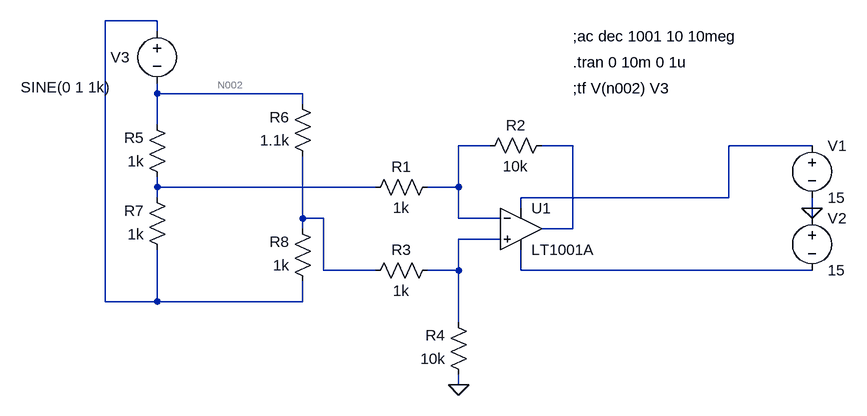
[diagram p0: schematic DifferentialAmp.asc]
DifferentialAmp.asc, the LTspice schematic file:
Version 4
SHEET 1 880 680
WIRE -240 -208 -320 -208
WIRE -240 -192 -240 -208
WIRE -240 -96 -240 -112
WIRE -16 -96 -240 -96
WIRE -16 -80 -16 -96
WIRE -240 -48 -240 -96
WIRE 272 -16 224 -16
WIRE 400 -16 352 -16
WIRE 768 -16 640 -16
WIRE -240 48 -240 32
WIRE 96 48 -240 48
WIRE 224 48 224 -16
WIRE 224 48 176 48
WIRE -240 64 -240 48
WIRE 640 64 640 -16
WIRE 640 64 320 64
WIRE 320 80 320 64
WIRE 768 80 768 64
WIRE -16 96 -16 0
WIRE 16 96 -16 96
WIRE 224 96 224 48
WIRE 288 96 224 96
WIRE 768 96 768 80
WIRE -16 112 -16 96
WIRE 400 112 400 -16
WIRE 400 112 352 112
WIRE 288 128 224 128
WIRE 16 176 16 96
WIRE 96 176 16 176
WIRE 224 176 224 128
WIRE 224 176 176 176
WIRE 320 176 320 144
WIRE 768 176 320 176
WIRE -320 224 -320 -208
WIRE -240 224 -240 144
WIRE -240 224 -320 224
WIRE -16 224 -16 192
WIRE -16 224 -240 224
WIRE 224 256 224 176
WIRE 224 352 224 336
FLAG 768 80 0
FLAG 224 352 0
SYMBOL res 192 32 R90
WINDOW 0 0 56 VBottom 2
WINDOW 3 32 56 VTop 2
SYMATTR InstName R1
SYMATTR Value 1k
SYMBOL res 368 -32 R90
WINDOW 0 0 56 VBottom 2
WINDOW 3 32 56 VTop 2
SYMATTR InstName R2
SYMATTR Value 10k
SYMBOL res 192 160 R90
WINDOW 0 0 56 VBottom 2
WINDOW 3 32 56 VTop 2
SYMATTR InstName R3
SYMATTR Value 1k
SYMBOL voltage 768 -32 R0
WINDOW 123 0 0 Left 2
WINDOW 39 0 0 Left 2
SYMATTR InstName V1
SYMATTR Value 15
SYMBOL voltage 768 80 R0
WINDOW 123 0 0 Left 2
WINDOW 39 0 0 Left 2
SYMATTR InstName V2
SYMATTR Value 15
SYMBOL Opamps\\LT1001A 320 48 R0
SYMATTR InstName U1
SYMBOL voltage -240 -208 R0
WINDOW 0 -72 56 Left 2
WINDOW 3 -210 102 Left 2
WINDOW 123 -154 130 Left 2
WINDOW 39 0 0 Left 2
SYMATTR InstName V3
SYMATTR Value SINE(0 1 1k)
SYMBOL res 240 352 R180
WINDOW 0 36 76 Left 2
WINDOW 3 36 40 Left 2
SYMATTR InstName R4
SYMATTR Value 10k
SYMBOL res -224 48 R180
WINDOW 0 36 76 Left 2
WINDOW 3 36 40 Left 2
SYMATTR InstName R5
SYMATTR Value 1k
SYMBOL res 0 16 R180
WINDOW 0 36 76 Left 2
WINDOW 3 36 40 Left 2
SYMATTR InstName R6
SYMATTR Value 1.1k
SYMBOL res -224 160 R180
WINDOW 0 36 76 Left 2
WINDOW 3 36 40 Left 2
SYMATTR InstName R7
SYMATTR Value 1k
SYMBOL res 0 208 R180
WINDOW 0 36 76 Left 2
WINDOW 3 36 40 Left 2
SYMATTR InstName R8
SYMATTR Value 1k
TEXT 400 -144 Left 2 !.tran 0 10m 0 1u
TEXT 400 -104 Left 2 !;tf V(n002) V3
TEXT 400 -184 Left 2 !;ac dec 1001 10 10meg

The netlist it stands for:
* DifferentialAmp.asc
R1 N003 N006 1k
R2 N004 N003 10k
R3 N008 N007 1k
V1 N005 0 15
V2 0 N009 15
XU1 N008 N003 N005 N009 N004 LT1001  ; LT1001A, pins In+ In- V+ V- OUT
V3 N001 N002 SINE(0 1 1k)
R4 0 N008 10k
R5 N006 N002 1k
R6 N007 N002 1.1k
R7 N001 N006 1k
R8 N001 N007 1k
.tran 0 10m 0 1u
;tf V(n002) V3
;ac dec 1001 10 10meg
.lib LTC.lib
.backanno
.end